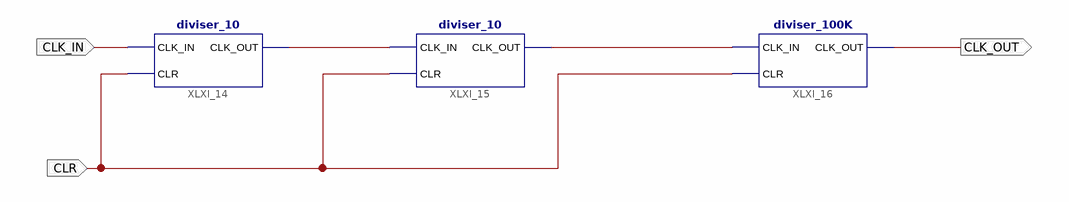
[diagram p0: schematic sheet 1]
// Xilinx ISE schematic CLK_Divider_To_2Hz.sch (spartan6) as structural Verilog: 3 symbols, 3 ports
module CLK_Divider_To_2Hz (
  input  CLK_IN,
  input  CLR,
  output CLK_OUT
);

  wire XLXN_1, XLXN_2;

  diviser_10 XLXI_14 (.CLK_IN(CLK_IN), .CLK_OUT(XLXN_2), .CLR(CLR));
  diviser_10 XLXI_15 (.CLK_IN(XLXN_2), .CLK_OUT(XLXN_1), .CLR(CLR));
  diviser_100K XLXI_16 (.CLK_IN(XLXN_1), .CLK_OUT(CLK_OUT), .CLR(CLR));
endmodule
